# EAGLE schematic untitled (EAGLE 7.7.0)
BANK SELECT

## Sheet 1 of 4: BANK 0
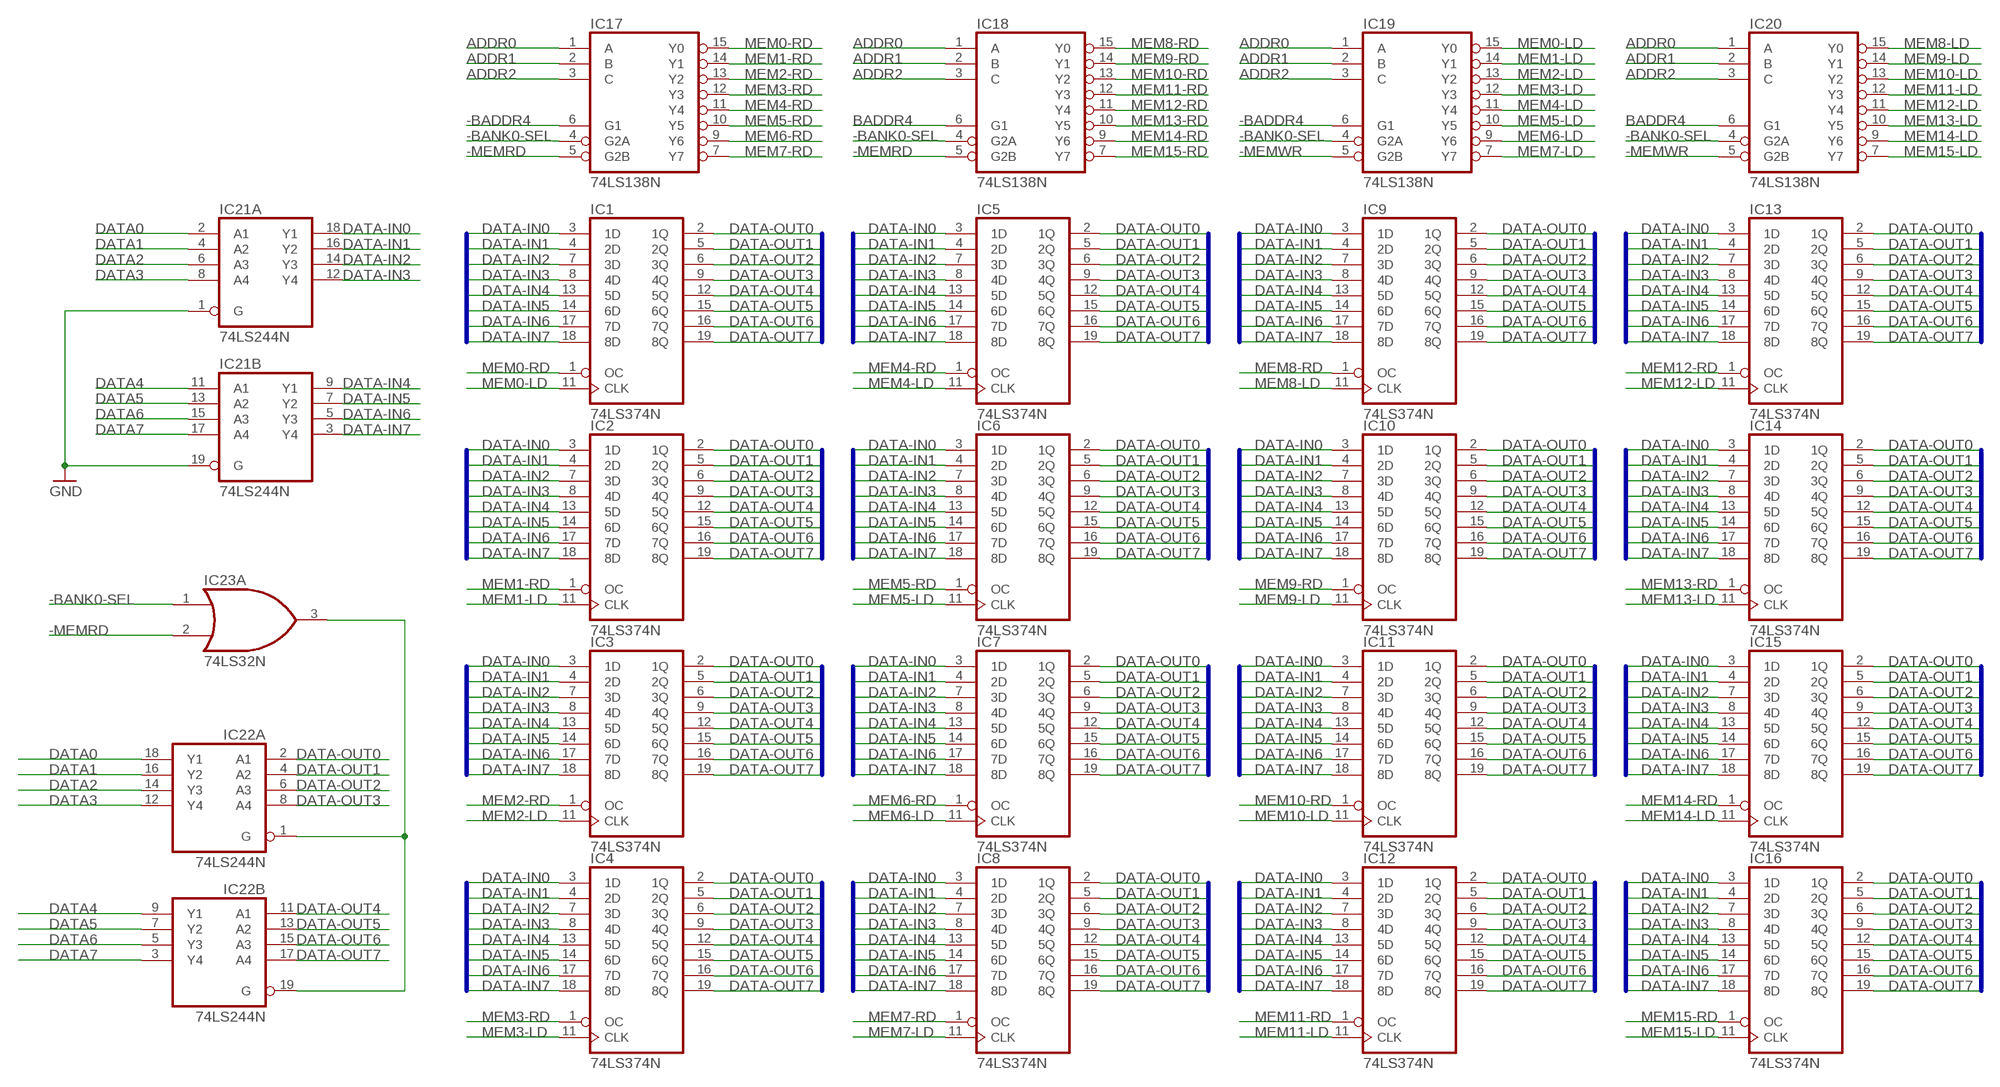
[diagram p0: schematic, sheet 1]

### Parts
IC1  74LS374N  [DIL20]
IC2  74LS374N  [DIL20]
IC3  74LS374N  [DIL20]
IC4  74LS374N  [DIL20]
IC5  74LS374N  [DIL20]
IC6  74LS374N  [DIL20]
IC7  74LS374N  [DIL20]
IC8  74LS374N  [DIL20]
IC9  74LS374N  [DIL20]
IC10  74LS374N  [DIL20]
IC11  74LS374N  [DIL20]
IC12  74LS374N  [DIL20]
IC13  74LS374N  [DIL20]
IC14  74LS374N  [DIL20]
IC15  74LS374N  [DIL20]
IC16  74LS374N  [DIL20]
IC17  74LS138N  [DIL16]
IC18  74LS138N  [DIL16]
IC19  74LS138N  [DIL16]
IC20  74LS138N  [DIL16]
IC21  74LS244N  [DIL20]
IC22  74LS244N  [DIL20]
IC23  74LS32N  [DIL14]

### Nets
-BADDR4: IC17.6(G1) IC19.6(G1) ; also sheet 3,4
-BANK0-SEL: IC17.4(G2A) IC18.4(G2A) IC19.4(G2A) IC20.4(G2A) IC23.1(A:I0) ; also sheet 3
-MEMRD: IC17.5(G2B) IC18.5(G2B) IC23.2(A:I1) ; also sheet 3,4
-MEMWR: IC19.5(G2B) IC20.5(G2B) ; also sheet 3,4
ADDR0: IC17.1(A) IC18.1(A) IC19.1(A) IC20.1(A) ; also sheet 2,4
ADDR1: IC17.2(B) IC18.2(B) IC19.2(B) IC20.2(B) ; also sheet 2,4
ADDR2: IC17.3(C) IC18.3(C) IC19.3(C) IC20.3(C) ; also sheet 2,4
BADDR4: IC18.6(G1) IC20.6(G1) ; also sheet 3,4
DATA0: IC21.2(A:A1) IC22.18(A:Y1) ; also sheet 2,4
DATA1: IC21.4(A:A2) IC22.16(A:Y2) ; also sheet 2,4
DATA2: IC21.6(A:A3) IC22.14(A:Y3) ; also sheet 2,4
DATA3: IC21.8(A:A4) IC22.12(A:Y4) ; also sheet 2,4
DATA4: IC21.11(B:A1) IC22.9(B:Y1) ; also sheet 2,4
DATA5: IC21.13(B:A2) IC22.7(B:Y2) ; also sheet 2,4
DATA6: IC21.15(B:A3) IC22.5(B:Y3) ; also sheet 2,4
DATA7: IC21.17(B:A4) IC22.3(B:Y4) ; also sheet 2,4
DATA-IN0: IC1.3(1D) IC2.3(1D) IC3.3(1D) IC4.3(1D) IC5.3(1D) IC6.3(1D) IC7.3(1D) IC8.3(1D) IC9.3(1D) IC10.3(1D) IC11.3(1D) IC12.3(1D) IC13.3(1D) IC14.3(1D) IC15.3(1D) IC16.3(1D) IC21.18(A:Y1)
DATA-IN1: IC1.4(2D) IC2.4(2D) IC3.4(2D) IC4.4(2D) IC5.4(2D) IC6.4(2D) IC7.4(2D) IC8.4(2D) IC9.4(2D) IC10.4(2D) IC11.4(2D) IC12.4(2D) IC13.4(2D) IC14.4(2D) IC15.4(2D) IC16.4(2D) IC21.16(A:Y2)
DATA-IN2: IC1.7(3D) IC2.7(3D) IC3.7(3D) IC4.7(3D) IC5.7(3D) IC6.7(3D) IC7.7(3D) IC8.7(3D) IC9.7(3D) IC10.7(3D) IC11.7(3D) IC12.7(3D) IC13.7(3D) IC14.7(3D) IC15.7(3D) IC16.7(3D) IC21.14(A:Y3)
DATA-IN3: IC1.8(4D) IC2.8(4D) IC3.8(4D) IC4.8(4D) IC5.8(4D) IC6.8(4D) IC7.8(4D) IC8.8(4D) IC9.8(4D) IC10.8(4D) IC11.8(4D) IC12.8(4D) IC13.8(4D) IC14.8(4D) IC15.8(4D) IC16.8(4D) IC21.12(A:Y4)
DATA-IN4: IC1.13(5D) IC2.13(5D) IC3.13(5D) IC4.13(5D) IC5.13(5D) IC6.13(5D) IC7.13(5D) IC8.13(5D) IC9.13(5D) IC10.13(5D) IC11.13(5D) IC12.13(5D) IC13.13(5D) IC14.13(5D) IC15.13(5D) IC16.13(5D) IC21.9(B:Y1)
DATA-IN5: IC1.14(6D) IC2.14(6D) IC3.14(6D) IC4.14(6D) IC5.14(6D) IC6.14(6D) IC7.14(6D) IC8.14(6D) IC9.14(6D) IC10.14(6D) IC11.14(6D) IC12.14(6D) IC13.14(6D) IC14.14(6D) IC15.14(6D) IC16.14(6D) IC21.7(B:Y2)
DATA-IN6: IC1.17(7D) IC2.17(7D) IC3.17(7D) IC4.17(7D) IC5.17(7D) IC6.17(7D) IC7.17(7D) IC8.17(7D) IC9.17(7D) IC10.17(7D) IC11.17(7D) IC12.17(7D) IC13.17(7D) IC14.17(7D) IC15.17(7D) IC16.17(7D) IC21.5(B:Y3)
DATA-IN7: IC1.18(8D) IC2.18(8D) IC3.18(8D) IC4.18(8D) IC5.18(8D) IC6.18(8D) IC7.18(8D) IC8.18(8D) IC9.18(8D) IC10.18(8D) IC11.18(8D) IC12.18(8D) IC13.18(8D) IC14.18(8D) IC15.18(8D) IC16.18(8D) IC21.3(B:Y4)
DATA-OUT0: IC1.2(1Q) IC2.2(1Q) IC3.2(1Q) IC4.2(1Q) IC5.2(1Q) IC6.2(1Q) IC7.2(1Q) IC8.2(1Q) IC9.2(1Q) IC10.2(1Q) IC11.2(1Q) IC12.2(1Q) IC13.2(1Q) IC14.2(1Q) IC15.2(1Q) IC16.2(1Q) IC22.2(A:A1)
DATA-OUT1: IC1.5(2Q) IC2.5(2Q) IC3.5(2Q) IC4.5(2Q) IC5.5(2Q) IC6.5(2Q) IC7.5(2Q) IC8.5(2Q) IC9.5(2Q) IC10.5(2Q) IC11.5(2Q) IC12.5(2Q) IC13.5(2Q) IC14.5(2Q) IC15.5(2Q) IC16.5(2Q) IC22.4(A:A2)
DATA-OUT2: IC1.6(3Q) IC2.6(3Q) IC3.6(3Q) IC4.6(3Q) IC5.6(3Q) IC6.6(3Q) IC7.6(3Q) IC8.6(3Q) IC9.6(3Q) IC10.6(3Q) IC11.6(3Q) IC12.6(3Q) IC13.6(3Q) IC14.6(3Q) IC15.6(3Q) IC16.6(3Q) IC22.6(A:A3)
DATA-OUT3: IC1.9(4Q) IC2.9(4Q) IC3.9(4Q) IC4.9(4Q) IC5.9(4Q) IC6.9(4Q) IC7.9(4Q) IC8.9(4Q) IC9.9(4Q) IC10.9(4Q) IC11.9(4Q) IC12.9(4Q) IC13.9(4Q) IC14.9(4Q) IC15.9(4Q) IC16.9(4Q) IC22.8(A:A4)
DATA-OUT4: IC1.12(5Q) IC2.12(5Q) IC3.12(5Q) IC4.12(5Q) IC5.12(5Q) IC6.12(5Q) IC7.12(5Q) IC8.12(5Q) IC9.12(5Q) IC10.12(5Q) IC11.12(5Q) IC12.12(5Q) IC13.12(5Q) IC14.12(5Q) IC15.12(5Q) IC16.12(5Q) IC22.11(B:A1)
DATA-OUT5: IC1.15(6Q) IC2.15(6Q) IC3.15(6Q) IC4.15(6Q) IC5.15(6Q) IC6.15(6Q) IC7.15(6Q) IC8.15(6Q) IC9.15(6Q) IC10.15(6Q) IC11.15(6Q) IC12.15(6Q) IC13.15(6Q) IC14.15(6Q) IC15.15(6Q) IC16.15(6Q) IC22.13(B:A2)
DATA-OUT6: IC1.16(7Q) IC2.16(7Q) IC3.16(7Q) IC4.16(7Q) IC5.16(7Q) IC6.16(7Q) IC7.16(7Q) IC8.16(7Q) IC9.16(7Q) IC10.16(7Q) IC11.16(7Q) IC12.16(7Q) IC13.16(7Q) IC14.16(7Q) IC15.16(7Q) IC16.16(7Q) IC22.15(B:A3)
DATA-OUT7: IC1.19(8Q) IC2.19(8Q) IC3.19(8Q) IC4.19(8Q) IC5.19(8Q) IC6.19(8Q) IC7.19(8Q) IC8.19(8Q) IC9.19(8Q) IC10.19(8Q) IC11.19(8Q) IC12.19(8Q) IC13.19(8Q) IC14.19(8Q) IC15.19(8Q) IC16.19(8Q) IC22.17(B:A4)
GND: IC21.1(A:G) IC21.19(B:G) ; also sheet 2,3,4
MEM0-LD: IC1.11(CLK) IC19.15(Y0)
MEM0-RD: IC1.1(OC) IC17.15(Y0)
MEM1-LD: IC2.11(CLK) IC19.14(Y1)
MEM1-RD: IC2.1(OC) IC17.14(Y1)
MEM2-LD: IC3.11(CLK) IC19.13(Y2)
MEM2-RD: IC3.1(OC) IC17.13(Y2)
MEM3-LD: IC4.11(CLK) IC19.12(Y3)
MEM3-RD: IC4.1(OC) IC17.12(Y3)
MEM4-LD: IC5.11(CLK) IC19.11(Y4)
MEM4-RD: IC5.1(OC) IC17.11(Y4)
MEM5-LD: IC6.11(CLK) IC19.10(Y5)
MEM5-RD: IC6.1(OC) IC17.10(Y5)
MEM6-LD: IC7.11(CLK) IC19.9(Y6)
MEM6-RD: IC7.1(OC) IC17.9(Y6)
MEM7-LD: IC8.11(CLK) IC19.7(Y7)
MEM7-RD: IC8.1(OC) IC17.7(Y7)
MEM8-LD: IC9.11(CLK) IC20.15(Y0)
MEM8-RD: IC9.1(OC) IC18.15(Y0)
MEM9-LD: IC10.11(CLK) IC20.14(Y1)
MEM9-RD: IC10.1(OC) IC18.14(Y1)
MEM10-LD: IC11.11(CLK) IC20.13(Y2)
MEM10-RD: IC11.1(OC) IC18.13(Y2)
MEM11-LD: IC12.11(CLK) IC20.12(Y3)
MEM11-RD: IC12.1(OC) IC18.12(Y3)
MEM12-LD: IC13.11(CLK) IC20.11(Y4)
MEM12-RD: IC13.1(OC) IC18.11(Y4)
MEM13-LD: IC14.11(CLK) IC20.10(Y5)
MEM13-RD: IC14.1(OC) IC18.10(Y5)
MEM14-LD: IC15.11(CLK) IC20.9(Y6)
MEM14-RD: IC15.1(OC) IC18.9(Y6)
MEM15-LD: IC16.11(CLK) IC20.7(Y7)
MEM15-RD: IC16.1(OC) IC18.7(Y7)
N$1: IC22.1(A:G) IC22.19(B:G) IC23.3(A:O)

### Buses
DATA-IN[0..7]
DATA-OUT[0..7]

## Sheet 2 of 4: BUS
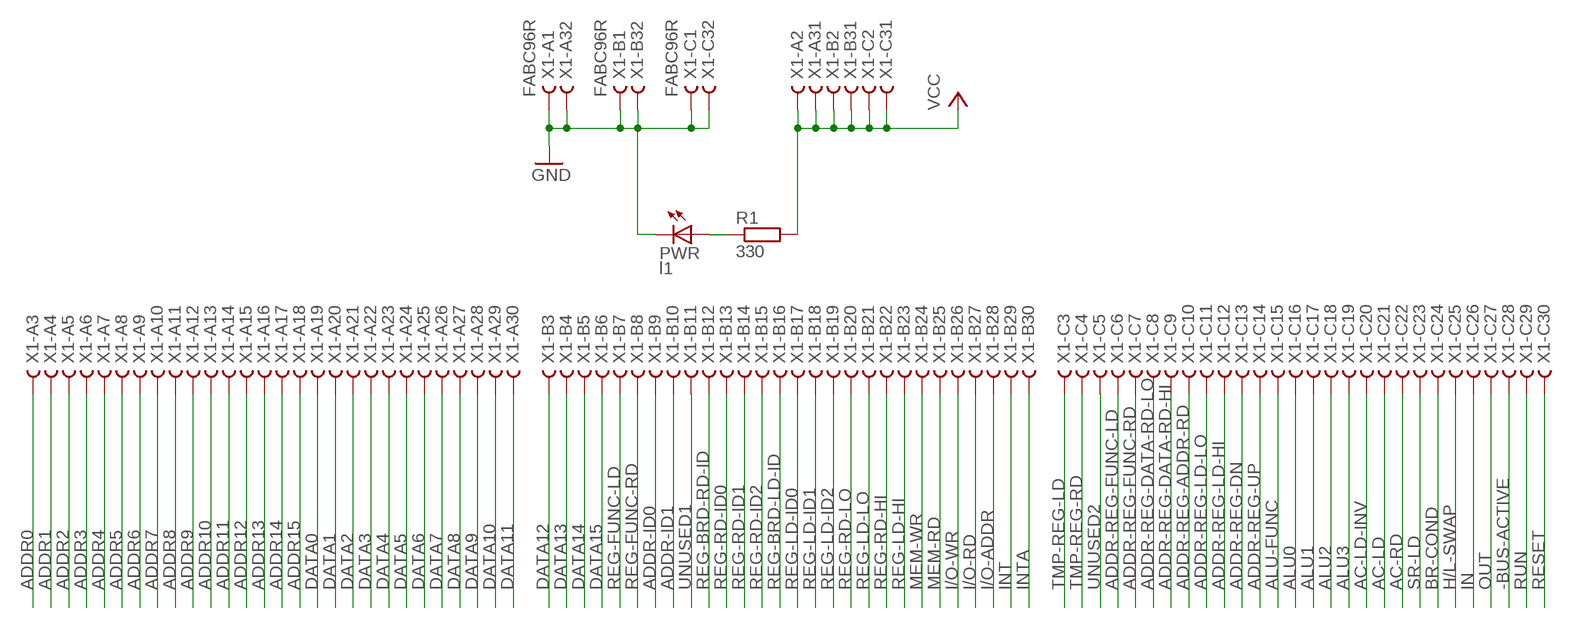
[diagram p1: schematic, sheet 2]

### Parts
PWR  l1  LED5MM  [LED5MM]
R1  330  R0207/10  [0207/10]
X1  FABC96R  [FABC96R]

### Nets
-BUS-ACTIVE: X1.C28 ; also sheet 3
AC-LD: X1.C21
AC-LD-INV: X1.C20
AC-RD: X1.C22
ADDR0: X1.A3 ; also sheet 1,4
ADDR1: X1.A4 ; also sheet 1,4
ADDR2: X1.A5 ; also sheet 1,4
ADDR3: X1.A6
ADDR4: X1.A7 ; also sheet 3
ADDR5: X1.A8 ; also sheet 3
ADDR6: X1.A9 ; also sheet 3
ADDR7: X1.A10
ADDR8: X1.A11
ADDR9: X1.A12
ADDR10: X1.A13
ADDR11: X1.A14
ADDR12: X1.A15
ADDR13: X1.A16
ADDR14: X1.A17
ADDR15: X1.A18
ADDR-ID0: X1.B9
ADDR-ID1: X1.B10
ADDR-REG-ADDR-RD: X1.C10
ADDR-REG-DATA-RD-HI: X1.C9
ADDR-REG-DATA-RD-LO: X1.C8
ADDR-REG-DN: X1.C13
ADDR-REG-FUNC-LD: X1.C6
ADDR-REG-FUNC-RD: X1.C7
ADDR-REG-LD-HI: X1.C12
ADDR-REG-LD-LO: X1.C11
ADDR-REG-UP: X1.C14
ALU0: X1.C16
ALU1: X1.C17
ALU2: X1.C18
ALU3: X1.C19
ALU-FUNC: X1.C15
BR-COND: X1.C24
DATA0: X1.A19 ; also sheet 1,4
DATA1: X1.A20 ; also sheet 1,4
DATA2: X1.A21 ; also sheet 1,4
DATA3: X1.A22 ; also sheet 1,4
DATA4: X1.A23 ; also sheet 1,4
DATA5: X1.A24 ; also sheet 1,4
DATA6: X1.A25 ; also sheet 1,4
DATA7: X1.A26 ; also sheet 1,4
DATA8: X1.A27
DATA9: X1.A28
DATA10: X1.A29
DATA11: X1.A30
DATA12: X1.B3
DATA13: X1.B4
DATA14: X1.B5
DATA15: X1.B6
GND: PWR.K(C) X1.A1 X1.A32 X1.B1 X1.B32 X1.C1 X1.C32 ; also sheet 1,3,4
H/L-SWAP: X1.C25
I/O-ADDR: X1.B28
I/O-RD: X1.B27
I/O-WR: X1.B26
IN: X1.C26
INT: X1.B29
INTA: X1.B30
MEM-RD: X1.B25 ; also sheet 3
MEM-WR: X1.B24 ; also sheet 3
N$30: PWR.A R1.1
OUT: X1.C27
REG-BRD-LD-ID: X1.B16
REG-BRD-RD-ID: X1.B12
REG-FUNC-LD: X1.B7
REG-FUNC-RD: X1.B8
REG-LD-HI: X1.B23
REG-LD-ID0: X1.B17
REG-LD-ID1: X1.B18
REG-LD-ID2: X1.B19
REG-LD-LO: X1.B21
REG-RD-HI: X1.B22
REG-RD-ID0: X1.B13
REG-RD-ID1: X1.B14
REG-RD-ID2: X1.B15
REG-RD-LO: X1.B20
RESET: X1.C30
RUN: X1.C29
SR-LD: X1.C23
TMP-REG-LD: X1.C3
TMP-REG-RD: X1.C4
UNUSED1: X1.B11
UNUSED2: X1.C5
VCC: R1.2 X1.A2 X1.A31 X1.B2 X1.B31 X1.C2 X1.C31

## Sheet 3 of 4: BANK SELECT
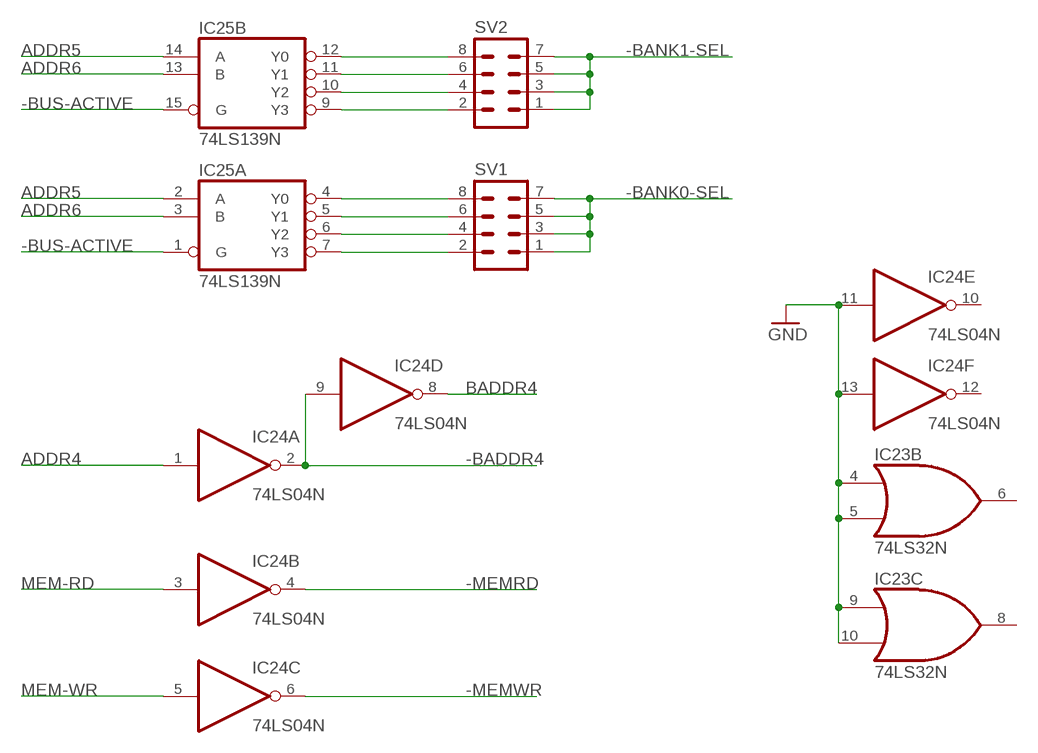
[diagram p2: schematic, sheet 3]

### Parts
IC24  74LS04N  [DIL14]
IC25  74LS139N  [DIL16]
SV1  MA04-2  [MA04-2]
SV2  MA04-2  [MA04-2]

### Nets
-BADDR4: IC24.2(A:O) IC24.9(D:I) ; also sheet 1,4
-BANK0-SEL: SV1.1 SV1.3 SV1.5 SV1.7 ; also sheet 1
-BANK1-SEL: SV2.1 SV2.3 SV2.5 SV2.7 ; also sheet 4
-BUS-ACTIVE: IC25.1(A:G) IC25.15(B:G) ; also sheet 2
-MEMRD: IC24.4(B:O) ; also sheet 1,4
-MEMWR: IC24.6(C:O) ; also sheet 1,4
ADDR4: IC24.1(A:I) ; also sheet 2
ADDR5: IC25.2(A:A) IC25.14(B:A) ; also sheet 2
ADDR6: IC25.3(A:B) IC25.13(B:B) ; also sheet 2
BADDR4: IC24.8(D:O) ; also sheet 1,4
GND: IC23.4(B:I0) IC23.5(B:I1) IC23.9(C:I0) IC23.10(C:I1) IC24.11(E:I) IC24.13(F:I) ; also sheet 1,2,4
MEM-RD: IC24.3(B:I) ; also sheet 2
MEM-WR: IC24.5(C:I) ; also sheet 2
N$2: IC25.12(B:Y0) SV2.8
N$3: IC25.11(B:Y1) SV2.6
N$4: IC25.4(A:Y0) SV1.8
N$5: IC25.5(A:Y1) SV1.6
N$6: IC25.6(A:Y2) SV1.4
N$7: IC25.7(A:Y3) SV1.2
N$8: IC25.10(B:Y2) SV2.4
N$9: IC25.9(B:Y3) SV2.2
Unconnected: IC23.6(B:O) IC23.8(C:O) IC24.10(E:O) IC24.12(F:O)

## Sheet 4 of 4: BANK 1
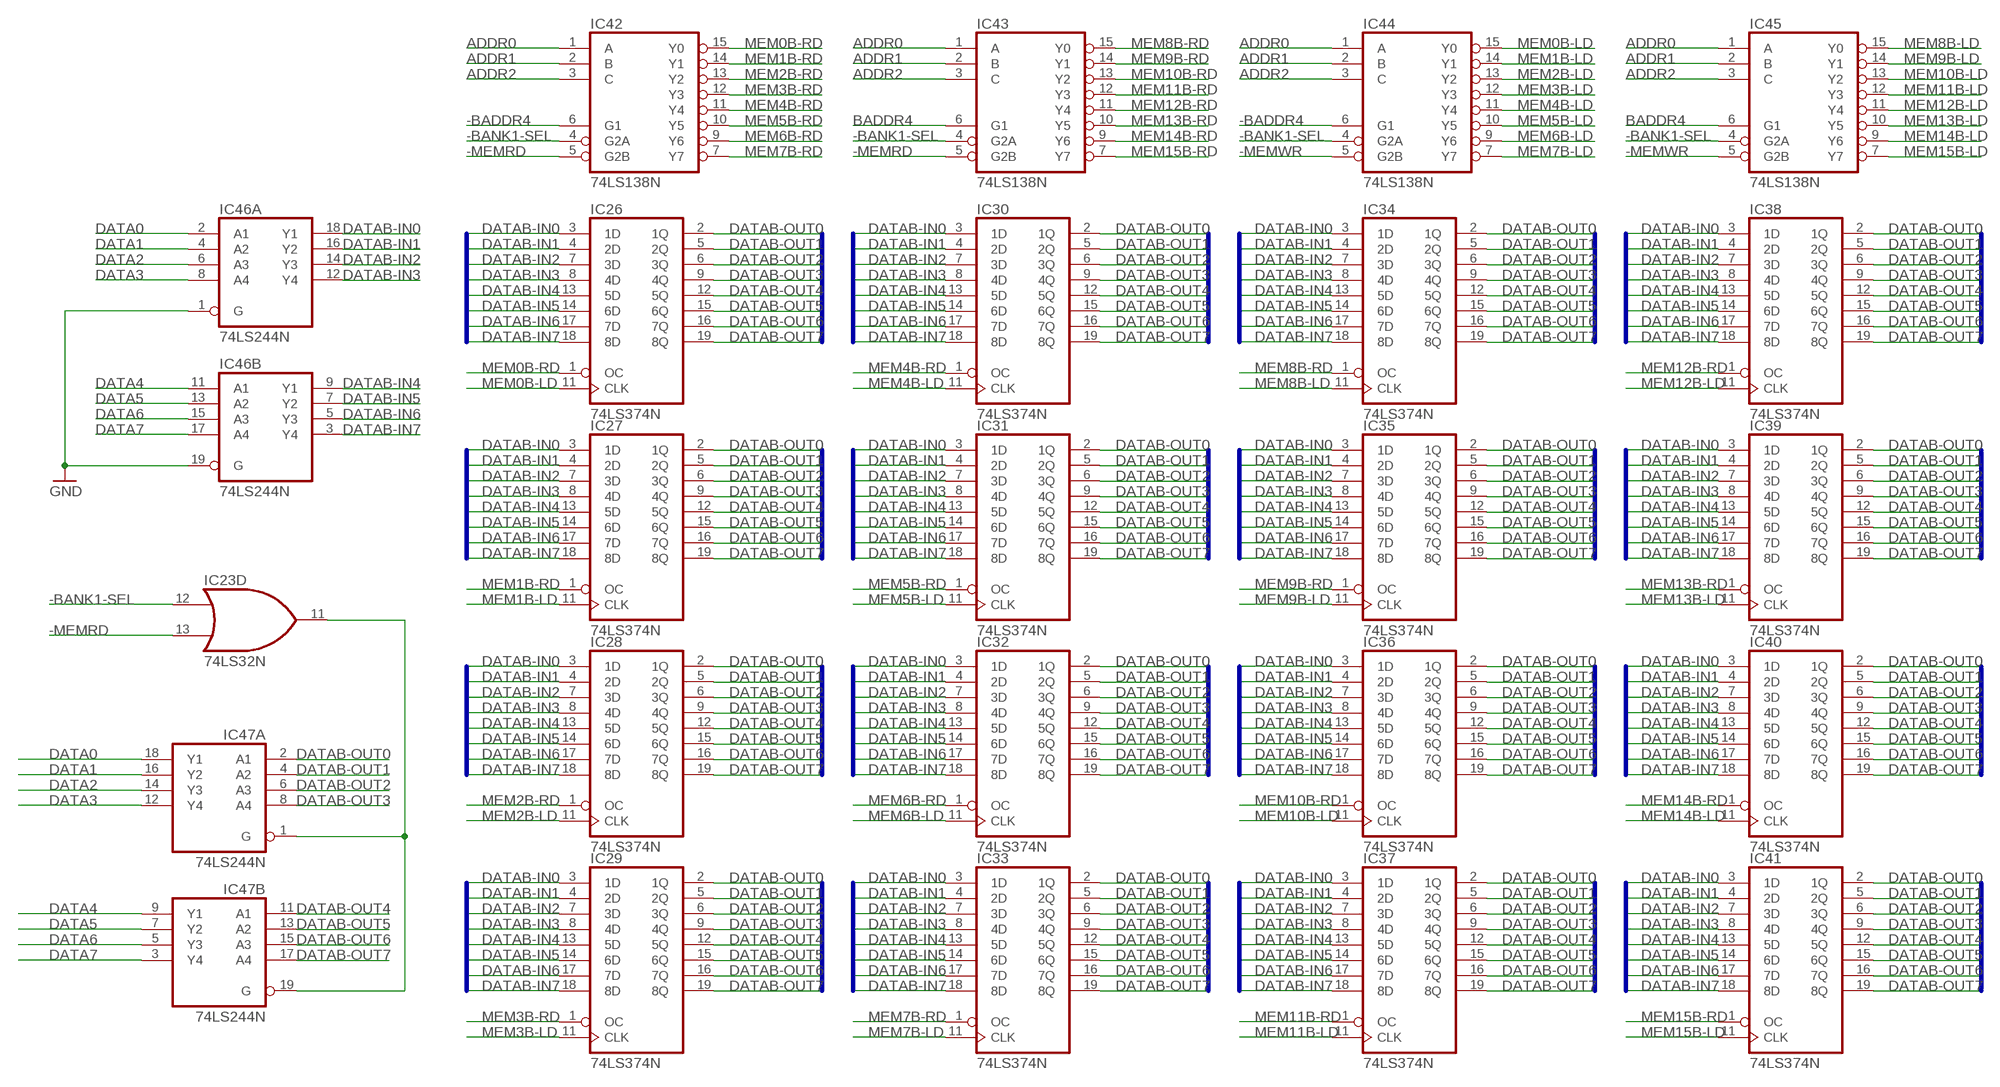
[diagram p3: schematic, sheet 4]

### Parts
IC26  74LS374N  [DIL20]
IC27  74LS374N  [DIL20]
IC28  74LS374N  [DIL20]
IC29  74LS374N  [DIL20]
IC30  74LS374N  [DIL20]
IC31  74LS374N  [DIL20]
IC32  74LS374N  [DIL20]
IC33  74LS374N  [DIL20]
IC34  74LS374N  [DIL20]
IC35  74LS374N  [DIL20]
IC36  74LS374N  [DIL20]
IC37  74LS374N  [DIL20]
IC38  74LS374N  [DIL20]
IC39  74LS374N  [DIL20]
IC40  74LS374N  [DIL20]
IC41  74LS374N  [DIL20]
IC42  74LS138N  [DIL16]
IC43  74LS138N  [DIL16]
IC44  74LS138N  [DIL16]
IC45  74LS138N  [DIL16]
IC46  74LS244N  [DIL20]
IC47  74LS244N  [DIL20]

### Nets
-BADDR4: IC42.6(G1) IC44.6(G1) ; also sheet 1,3
-BANK1-SEL: IC23.12(D:I0) IC42.4(G2A) IC43.4(G2A) IC44.4(G2A) IC45.4(G2A) ; also sheet 3
-MEMRD: IC23.13(D:I1) IC42.5(G2B) IC43.5(G2B) ; also sheet 1,3
-MEMWR: IC44.5(G2B) IC45.5(G2B) ; also sheet 1,3
ADDR0: IC42.1(A) IC43.1(A) IC44.1(A) IC45.1(A) ; also sheet 1,2
ADDR1: IC42.2(B) IC43.2(B) IC44.2(B) IC45.2(B) ; also sheet 1,2
ADDR2: IC42.3(C) IC43.3(C) IC44.3(C) IC45.3(C) ; also sheet 1,2
BADDR4: IC43.6(G1) IC45.6(G1) ; also sheet 1,3
DATA0: IC46.2(A:A1) IC47.18(A:Y1) ; also sheet 1,2
DATA1: IC46.4(A:A2) IC47.16(A:Y2) ; also sheet 1,2
DATA2: IC46.6(A:A3) IC47.14(A:Y3) ; also sheet 1,2
DATA3: IC46.8(A:A4) IC47.12(A:Y4) ; also sheet 1,2
DATA4: IC46.11(B:A1) IC47.9(B:Y1) ; also sheet 1,2
DATA5: IC46.13(B:A2) IC47.7(B:Y2) ; also sheet 1,2
DATA6: IC46.15(B:A3) IC47.5(B:Y3) ; also sheet 1,2
DATA7: IC46.17(B:A4) IC47.3(B:Y4) ; also sheet 1,2
DATAB-IN0: IC26.3(1D) IC27.3(1D) IC28.3(1D) IC29.3(1D) IC30.3(1D) IC31.3(1D) IC32.3(1D) IC33.3(1D) IC34.3(1D) IC35.3(1D) IC36.3(1D) IC37.3(1D) IC38.3(1D) IC39.3(1D) IC40.3(1D) IC41.3(1D) IC46.18(A:Y1)
DATAB-IN1: IC26.4(2D) IC27.4(2D) IC28.4(2D) IC29.4(2D) IC30.4(2D) IC31.4(2D) IC32.4(2D) IC33.4(2D) IC34.4(2D) IC35.4(2D) IC36.4(2D) IC37.4(2D) IC38.4(2D) IC39.4(2D) IC40.4(2D) IC41.4(2D) IC46.16(A:Y2)
DATAB-IN2: IC26.7(3D) IC27.7(3D) IC28.7(3D) IC29.7(3D) IC30.7(3D) IC31.7(3D) IC32.7(3D) IC33.7(3D) IC34.7(3D) IC35.7(3D) IC36.7(3D) IC37.7(3D) IC38.7(3D) IC39.7(3D) IC40.7(3D) IC41.7(3D) IC46.14(A:Y3)
DATAB-IN3: IC26.8(4D) IC27.8(4D) IC28.8(4D) IC29.8(4D) IC30.8(4D) IC31.8(4D) IC32.8(4D) IC33.8(4D) IC34.8(4D) IC35.8(4D) IC36.8(4D) IC37.8(4D) IC38.8(4D) IC39.8(4D) IC40.8(4D) IC41.8(4D) IC46.12(A:Y4)
DATAB-IN4: IC26.13(5D) IC27.13(5D) IC28.13(5D) IC29.13(5D) IC30.13(5D) IC31.13(5D) IC32.13(5D) IC33.13(5D) IC34.13(5D) IC35.13(5D) IC36.13(5D) IC37.13(5D) IC38.13(5D) IC39.13(5D) IC40.13(5D) IC41.13(5D) IC46.9(B:Y1)
DATAB-IN5: IC26.14(6D) IC27.14(6D) IC28.14(6D) IC29.14(6D) IC30.14(6D) IC31.14(6D) IC32.14(6D) IC33.14(6D) IC34.14(6D) IC35.14(6D) IC36.14(6D) IC37.14(6D) IC38.14(6D) IC39.14(6D) IC40.14(6D) IC41.14(6D) IC46.7(B:Y2)
DATAB-IN6: IC26.17(7D) IC27.17(7D) IC28.17(7D) IC29.17(7D) IC30.17(7D) IC31.17(7D) IC32.17(7D) IC33.17(7D) IC34.17(7D) IC35.17(7D) IC36.17(7D) IC37.17(7D) IC38.17(7D) IC39.17(7D) IC40.17(7D) IC41.17(7D) IC46.5(B:Y3)
DATAB-IN7: IC26.18(8D) IC27.18(8D) IC28.18(8D) IC29.18(8D) IC30.18(8D) IC31.18(8D) IC32.18(8D) IC33.18(8D) IC34.18(8D) IC35.18(8D) IC36.18(8D) IC37.18(8D) IC38.18(8D) IC39.18(8D) IC40.18(8D) IC41.18(8D) IC46.3(B:Y4)
DATAB-OUT0: IC26.2(1Q) IC27.2(1Q) IC28.2(1Q) IC29.2(1Q) IC30.2(1Q) IC31.2(1Q) IC32.2(1Q) IC33.2(1Q) IC34.2(1Q) IC35.2(1Q) IC36.2(1Q) IC37.2(1Q) IC38.2(1Q) IC39.2(1Q) IC40.2(1Q) IC41.2(1Q) IC47.2(A:A1)
DATAB-OUT1: IC26.5(2Q) IC27.5(2Q) IC28.5(2Q) IC29.5(2Q) IC30.5(2Q) IC31.5(2Q) IC32.5(2Q) IC33.5(2Q) IC34.5(2Q) IC35.5(2Q) IC36.5(2Q) IC37.5(2Q) IC38.5(2Q) IC39.5(2Q) IC40.5(2Q) IC41.5(2Q) IC47.4(A:A2)
DATAB-OUT2: IC26.6(3Q) IC27.6(3Q) IC28.6(3Q) IC29.6(3Q) IC30.6(3Q) IC31.6(3Q) IC32.6(3Q) IC33.6(3Q) IC34.6(3Q) IC35.6(3Q) IC36.6(3Q) IC37.6(3Q) IC38.6(3Q) IC39.6(3Q) IC40.6(3Q) IC41.6(3Q) IC47.6(A:A3)
DATAB-OUT3: IC26.9(4Q) IC27.9(4Q) IC28.9(4Q) IC29.9(4Q) IC30.9(4Q) IC31.9(4Q) IC32.9(4Q) IC33.9(4Q) IC34.9(4Q) IC35.9(4Q) IC36.9(4Q) IC37.9(4Q) IC38.9(4Q) IC39.9(4Q) IC40.9(4Q) IC41.9(4Q) IC47.8(A:A4)
DATAB-OUT4: IC26.12(5Q) IC27.12(5Q) IC28.12(5Q) IC29.12(5Q) IC30.12(5Q) IC31.12(5Q) IC32.12(5Q) IC33.12(5Q) IC34.12(5Q) IC35.12(5Q) IC36.12(5Q) IC37.12(5Q) IC38.12(5Q) IC39.12(5Q) IC40.12(5Q) IC41.12(5Q) IC47.11(B:A1)
DATAB-OUT5: IC26.15(6Q) IC27.15(6Q) IC28.15(6Q) IC29.15(6Q) IC30.15(6Q) IC31.15(6Q) IC32.15(6Q) IC33.15(6Q) IC34.15(6Q) IC35.15(6Q) IC36.15(6Q) IC37.15(6Q) IC38.15(6Q) IC39.15(6Q) IC40.15(6Q) IC41.15(6Q) IC47.13(B:A2)
DATAB-OUT6: IC26.16(7Q) IC27.16(7Q) IC28.16(7Q) IC29.16(7Q) IC30.16(7Q) IC31.16(7Q) IC32.16(7Q) IC33.16(7Q) IC34.16(7Q) IC35.16(7Q) IC36.16(7Q) IC37.16(7Q) IC38.16(7Q) IC39.16(7Q) IC40.16(7Q) IC41.16(7Q) IC47.15(B:A3)
DATAB-OUT7: IC26.19(8Q) IC27.19(8Q) IC28.19(8Q) IC29.19(8Q) IC30.19(8Q) IC31.19(8Q) IC32.19(8Q) IC33.19(8Q) IC34.19(8Q) IC35.19(8Q) IC36.19(8Q) IC37.19(8Q) IC38.19(8Q) IC39.19(8Q) IC40.19(8Q) IC41.19(8Q) IC47.17(B:A4)
GND: IC46.1(A:G) IC46.19(B:G) ; also sheet 1,2,3
MEM0B-LD: IC26.11(CLK) IC44.15(Y0)
MEM0B-RD: IC26.1(OC) IC42.15(Y0)
MEM1B-LD: IC27.11(CLK) IC44.14(Y1)
MEM1B-RD: IC27.1(OC) IC42.14(Y1)
MEM2B-LD: IC28.11(CLK) IC44.13(Y2)
MEM2B-RD: IC28.1(OC) IC42.13(Y2)
MEM3B-LD: IC29.11(CLK) IC44.12(Y3)
MEM3B-RD: IC29.1(OC) IC42.12(Y3)
MEM4B-LD: IC30.11(CLK) IC44.11(Y4)
MEM4B-RD: IC30.1(OC) IC42.11(Y4)
MEM5B-LD: IC31.11(CLK) IC44.10(Y5)
MEM5B-RD: IC31.1(OC) IC42.10(Y5)
MEM6B-LD: IC32.11(CLK) IC44.9(Y6)
MEM6B-RD: IC32.1(OC) IC42.9(Y6)
MEM7B-LD: IC33.11(CLK) IC44.7(Y7)
MEM7B-RD: IC33.1(OC) IC42.7(Y7)
MEM8B-LD: IC34.11(CLK) IC45.15(Y0)
MEM8B-RD: IC34.1(OC) IC43.15(Y0)
MEM9B-LD: IC35.11(CLK) IC45.14(Y1)
MEM9B-RD: IC35.1(OC) IC43.14(Y1)
MEM10B-LD: IC36.11(CLK) IC45.13(Y2)
MEM10B-RD: IC36.1(OC) IC43.13(Y2)
MEM11B-LD: IC37.11(CLK) IC45.12(Y3)
MEM11B-RD: IC37.1(OC) IC43.12(Y3)
MEM12B-LD: IC38.11(CLK) IC45.11(Y4)
MEM12B-RD: IC38.1(OC) IC43.11(Y4)
MEM13B-LD: IC39.11(CLK) IC45.10(Y5)
MEM13B-RD: IC39.1(OC) IC43.10(Y5)
MEM14B-LD: IC40.11(CLK) IC45.9(Y6)
MEM14B-RD: IC40.1(OC) IC43.9(Y6)
MEM15B-LD: IC41.11(CLK) IC45.7(Y7)
MEM15B-RD: IC41.1(OC) IC43.7(Y7)
N$10: IC23.11(D:O) IC47.1(A:G) IC47.19(B:G)

### Buses
DATAB-IN[0..7]
DATAB-OUT[0..7]

## Power pins joined to a net without a drawn wire
GND: IC1.10(GND) IC2.10(GND) IC3.10(GND) IC4.10(GND) IC5.10(GND) IC6.10(GND) IC7.10(GND) IC8.10(GND) IC9.10(GND) IC10.10(GND) IC11.10(GND) IC12.10(GND) IC13.10(GND) IC14.10(GND) IC15.10(GND) IC16.10(GND) IC17.8(GND) IC18.8(GND) IC19.8(GND) IC20.8(GND) IC21.10(P:GND) IC22.10(P:GND) IC23.7(P:GND) IC24.7(P:GND) IC25.8(P:GND) IC26.10(GND) IC27.10(GND) IC28.10(GND) IC29.10(GND) IC30.10(GND) IC31.10(GND) IC32.10(GND) IC33.10(GND) IC34.10(GND) IC35.10(GND) IC36.10(GND) IC37.10(GND) IC38.10(GND) IC39.10(GND) IC40.10(GND) IC41.10(GND) IC42.8(GND) IC43.8(GND) IC44.8(GND) IC45.8(GND) IC46.10(P:GND) IC47.10(P:GND)
VCC: IC1.20(VCC) IC2.20(VCC) IC3.20(VCC) IC4.20(VCC) IC5.20(VCC) IC6.20(VCC) IC7.20(VCC) IC8.20(VCC) IC9.20(VCC) IC10.20(VCC) IC11.20(VCC) IC12.20(VCC) IC13.20(VCC) IC14.20(VCC) IC15.20(VCC) IC16.20(VCC) IC17.16(VCC) IC18.16(VCC) IC19.16(VCC) IC20.16(VCC) IC21.20(P:VCC) IC22.20(P:VCC) IC23.14(P:VCC) IC24.14(P:VCC) IC25.16(P:VCC) IC26.20(VCC) IC27.20(VCC) IC28.20(VCC) IC29.20(VCC) IC30.20(VCC) IC31.20(VCC) IC32.20(VCC) IC33.20(VCC) IC34.20(VCC) IC35.20(VCC) IC36.20(VCC) IC37.20(VCC) IC38.20(VCC) IC39.20(VCC) IC40.20(VCC) IC41.20(VCC) IC42.16(VCC) IC43.16(VCC) IC44.16(VCC) IC45.16(VCC) IC46.20(P:VCC) IC47.20(P:VCC)

## Library data of the parts
IC1-IC16 IC26-IC41 = 74xx-us:74*374: Octal D type transparent LATCH, edge triggered
IC17-IC20 IC42-IC45 = 74xx-us:74*138: 3-line to 8-line DECODER/DEMULTIPLEXER
IC21 IC22 IC46 IC47 = 74xx-us:74*244: Octal BUFFER and LINE DRIVER, 3-state
IC23 = 74xx-us:74*32: Quad 2-input OR gate
IC24 = 74xx-us:74*04: Hex INVERTER
IC25 = 74xx-us:74*139: Dual 2-line to 4-line DECODER/DEMULTIPLEXER
PWR = led:LED: LED OSRAM: - CHIPLED LG R971, LG N971, LY N971, LG Q971, LY Q971, LO R971, LY R971 LH N974, LH R974 LS Q976, LO Q976, LY Q976 LO Q996 - Hyper CHIPLED LW Q18S LB Q993, LB Q99A, LB R99A - SideLED LS A670, LO A670, LY A670, LG A670, LP A670 LB A673, LV A673, LT A673, LW A673 LH A674 LY A675 LS A676, LA A676, LO A676, LY A676, LW A676 LS A679, LY A679, LG A679 - Hyper Micro SIDELED® LS Y876, LA Y876, LO Y876, LY Y876 LT Y87S - SmartLED LW L88C, LW L88S LB L89C, LB L89S, LG L890 LS L89K, LO L89K, LY L89K LS L896, LA L896, LO L896, LY L896 - TOPLED LS T670, LO T670, LY T670, LG T670, LP T670 LSG T670, LSP T670, LSY T670, LOP T670, LYG T670 LG T671, LOG T671, LSG T671 LB T673, LV T673, LT T673, LW T673 LH T674 LS T676, LA T676, LO T676, LY T676, LB T676, LH T676, LSB T676, LW T676 LB T67C, LV T67C, LT T67C, LS T67K, LO T67K, LY T67K, LW E67C LS E67B, LA E67B, LO E67B, LY E67B, LB E67C, LV E67C, LT E67C LW T67C LS T679, LY T679, LG T679 LS T770, LO T770, LY T770, LG T770, LP T770 LB T773, LV T773, LT T773, LW T773 LH T774 LS E675, LA E675, LY E675, LS T675 LS T776, LA T776, LO T776, LY T776, LB T776 LHGB T686 LT T68C, LB T68C - Hyper Mini TOPLED® LB M676 - Mini TOPLED Santana® LG M470 LS M47K, LO M47K, LY M47K Source: http://www.osram.convergy.de LUXEON: - LUMILED® LXK2-PW12-R00, LXK2-PW12-S00, LXK2-PW14-U00, LXK2-PW14-V00 LXK2-PM12-R00, LXK2-PM12-S00, LXK2-PM14-U00 LXK2-PE12-Q00, LXK2-PE12-R00, LXK2-PE12-S00, LXK2-PE14-T00, LXK2-PE14-U00 LXK2-PB12-K00, LXK2-PB12-L00, LXK2-PB12-M00, LXK2-PB14-N00, LXK2-PB14-P00, LXK2-PB14-Q00 LXK2-PR12-L00, LXK2-PR12-M00, LXK2-PR14-Q00, LXK2-PR14-R00 LXK2-PD12-Q00, LXK2-PD12-R00, LXK2-PD12-S00 LXK2-PH12-R00, LXK2-PH12-S00 LXK2-PL12-P00, LXK2-PL12-Q00, LXK2-PL12-R00 Source: www.luxeon.com KINGBRIGHT: KA-3528ASYC Source: www.kingbright.com
R1 = eagle-ltspice:R: RESISTOR, European symbol; SPICEMODEL: NONE; SPICEPREFIX: R
SV1 SV2 = con-lstb:MA04-2: PIN HEADER; OC_FARNELL: unknown; OC_NEWARK: unknown
X1 = con-vg:FABC96R: CONNECTOR female, 96 pins, type R, rows ABC, grid 2.54 mm